# Altium project RoboBoardv2.PrjPCB
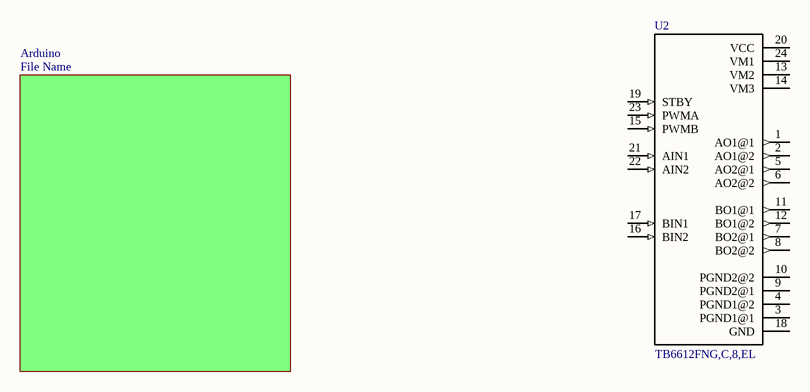
[diagram p0: Main.SchDoc]
2 sheets, 11 parts. Net scope: global (net labels, ports and power ports of the same name join across sheets).
Sheets:
  Main.SchDoc
  Arduino.SchDoc

## Sheet Main.SchDoc
size A4; Organization: Altium Limited; Address1: L3, 12a Rodborough Rd; Address2: Frenchs Forest; Address3: NSW; Address4: Australia 2086

### Parts
U2  TB6612FNG,C,8,EL  [SOP65P760X160-24N]

### Sub-sheets
Arduino = File Name (file not in this document): no entries

### Nets

Not connected (* = marked no-connect by the designer): U2 1(AO1@1) 2(AO1@2) 3(PGND1@1) 4(PGND1@2) 5(AO2@1) 6(AO2@2) 7(BO2@1) 8(BO2@2) 9(PGND2@1) 10(PGND2@2) 11(BO1@1) 12(BO1@2) 13(VM2) 14(VM3) 15(PWMB) 16(BIN2) 17(BIN1) 18(GND) 19(STBY) 20(VCC) 21(AIN1) 22(AIN2) 23(PWMA) 24(VM1)

### Notes on the sheet
- Title
- Size:
- Date:
- A4
- Number:
- Time:
- Revision:
- Sheet
- of
- File:

### Library data of the parts
U2 = TB6612FNG,C,8,EL: IC MOTOR DRIVER PAR 24SSOP; MF: Toshiba; Price: 1.39 USD; Availability: Good; MP: TB6612FNG,C,8,EL; Package: SSOP-24 Toshiba; Value: *

## Sheet Arduino.SchDoc
size A
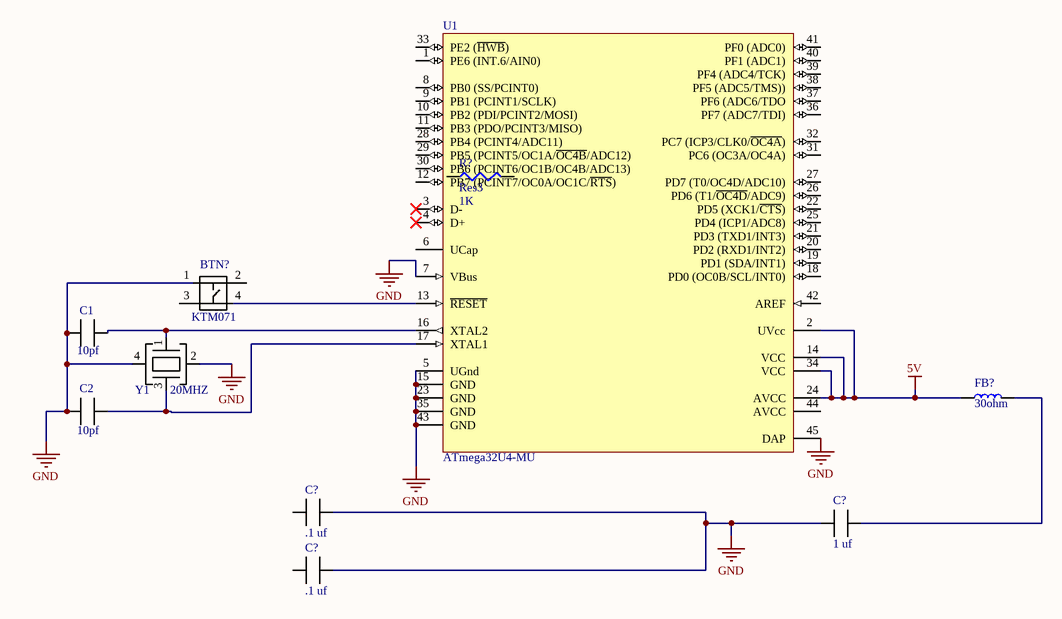
[diagram p1: Arduino.SchDoc]

### Parts
(Parts that share a designator on the sheet are numbered #1, #2 ... from top to bottom, then left to right.)
BTN?  KTM071  [KTM071]
C1  10pf  [1608[0603]]
C2  10pf  [1608[0603]]
C?#1  .1 uf  [1608[0603]]
C?#2  1 uf  [1608[0603]]
C?#3  .1 uf  [1608[0603]]
FB?  30ohm  [L0805]
R?  Res3  value 1K  [J1-0603]
U1  ATmega32U4-MU  [44PW_N]
Y1  20MHZ  [ABM11AIG]

### Nets
5V: FB?.1 U1.2(UVcc) U1.14(VCC) U1.24(AVCC) U1.34(VCC)
GND: BTN?.1 C1.2 C2.2 C?#1.1 C?#2.2 C?#3.1 U1.5(UGnd) U1.7(VBus) U1.15(GND) U1.23(GND) U1.35(GND) U1.43(GND) U1.45(DAP) Y1.2(GND) Y1.4(GND)
NetBTN?_4: BTN?.4 U1.13(~{RESET})
NetC1_1: C1.1 U1.16(XTAL2) Y1.1(IN)
NetC2_1: C2.1 U1.17(XTAL1) Y1.3(OUT)
NetC?#2_1: C?#2.1 FB?.2

Not connected (* = marked no-connect by the designer): BTN? 2(31) 3(29); C?#1 2; C?#3 2; R? 1 2; U1 1(PE6_(INT.6/AIN0)) 3(D-)* 4(D+)* 6(UCap) 8(PB0_(SS/PCINT0)) 9(PB1_(PCINT1/SCLK)) 10(PB2_(PDI/PCINT2/MOSI)) 11(PB3_(PDO/PCINT3/MISO)) 12(PB7_(PCINT7/OC0A/OC1C/~{RTS})) 18(PD0_(OC0B/SCL/INT0)) 19(PD1_(SDA/INT1)) 20(PD2_(RXD1/INT2)) 21(PD3_(TXD1/INT3)) 22(PD5_(XCK1/~{CTS})) 25(PD4_(ICP1/ADC8)) 26(PD6_(T1/~{OC4D}/ADC9)) 27(PD7_(T0/OC4D/ADC10)) 28(PB4_(PCINT4/ADC11)) 29(PB5_(PCINT5/OC1A/~{OC4B}/ADC12)) 30(PB6_(PCINT6/OC1B/OC4B/ADC13)) 31(PC6_(OC3A/OC4A)) 32(PC7_(ICP3/CLK0/~{OC4A})) 33(PE2_(~{HWB})) 36(PF7_(ADC7/TDI)) 37(PF6_(ADC6/TDO) 38(PF5_(ADC5/TMS))) 39(PF4_(ADC4/TCK)) 40(PF1_(ADC1)) 41(PF0_(ADC0)) 42(AREF) 44(AVCC)

### Library data of the parts
BTN? = KMT071: SWITCH TACTILE SPST-NO 0.05A 32V; Supplier 1: Digi-Key; Supplier Part Number 1: CKN10291CT-ND
C1 C2 = CAP CER 10PF: ComponentLink1Description: Datasheet; ComponentLink1URL: http://search.murata.co.jp/Ceramy/image/img/A01X/partnumbering_e_01.pdf; Supplier 1: Digi-Key; Supplier Part Number 1: 490-9682-1-ND
C?#1 C?#3 = CAP CER .1uf: .1uF 0603 SMT Capacitor; ComponentLink1Description: Datasheet; ComponentLink1URL: http://search.murata.co.jp/Ceramy/image/img/A01X/partnumbering_e_01.pdf; Supplier 1: Digi-Key; Supplier Part Number 1: 490-4774-6-ND
C?#2 = CAP CER 1uF: 1uF 0603 SMT Capacitor; ComponentLink1Description: Datasheet; ComponentLink1URL: http://search.murata.co.jp/Ceramy/image/img/A01X/partnumbering_e_01.pdf; Supplier 1: Digi-Key
FB? = SMD-FERRITE-BEAD-30R-3A(0805): FERRITE BEAD 30 OHM 0805 1LN; MP: MH2029-300Y; MF: Bourns; Price: 0.03 USD; Availability: Good; Package: 0805 Bourns; Value: *
R? = Res3: Resistor; Published: 8-Jun-2000; LatestRevisionDate: 29-May-2009; LatestRevisionNote: IPC-7351 Footprint Added.; PackageReference: J1-0603; Publisher: Altium Limited; PackageDescription: Chip Resistor
U1 = ATmega32U4-MU: 8-bit AVR Microcontroller, 2.7-5.5V, 32KB Flash, 2.5KB EEPROM, 1KB SRAM, USB Controller, 44-pin QFN, Industrial Grade (-40°C to 85°C); Published: 1-Apr-2010; DatasheetVersion: revD, Jan-2009; PackageVersion: revF, Jul-2007; PackageReference: 44PW; Publisher: Altium Limited; PackageDescription: 44-Pin Quad Flat No-Lead Package, 7 x 7 mm Body, 0.5 mm Pitch (QFN); Supplier 1: Digi-Key; Supplier Part Number 1: ATMEGA32U4-MU-ND; Supplier 2: Mouser; Supplier Part Number 2: 556-ATMEGA32U4-MU; Code_JEDEC: MO-220-VKKD-1; ComponentLink1Description: Manufacturer Link; ComponentLink1URL: http://www.atmel.com/products/avr/default.asp?; ComponentLink2Description: ATmega16U4/32U4 Datasheet; ComponentLink2URL: http://www.atmel.com/dyn/resources/prod_documents/doc7766.pdf; ComponentLink3Description: ATmega16U4 ATmega32U4 Summary; ComponentLink3URL: http://www.atmel.com/dyn/resources/prod_documents/7766S.pdf; ComponentLink4Description: Atmel.com Home; ComponentLink4URL: http://www.atmel.com
Y1 = ABM11AIG-20.000MHZ-4Z-T3: 20MHZ Crystal Oscillator; Supplier 1: Digi-Key; ComponentLink1Description: Datasheet; ComponentLink1URL: http://www.abracon.com/AIGcrystals/ABM11AIG.pdf